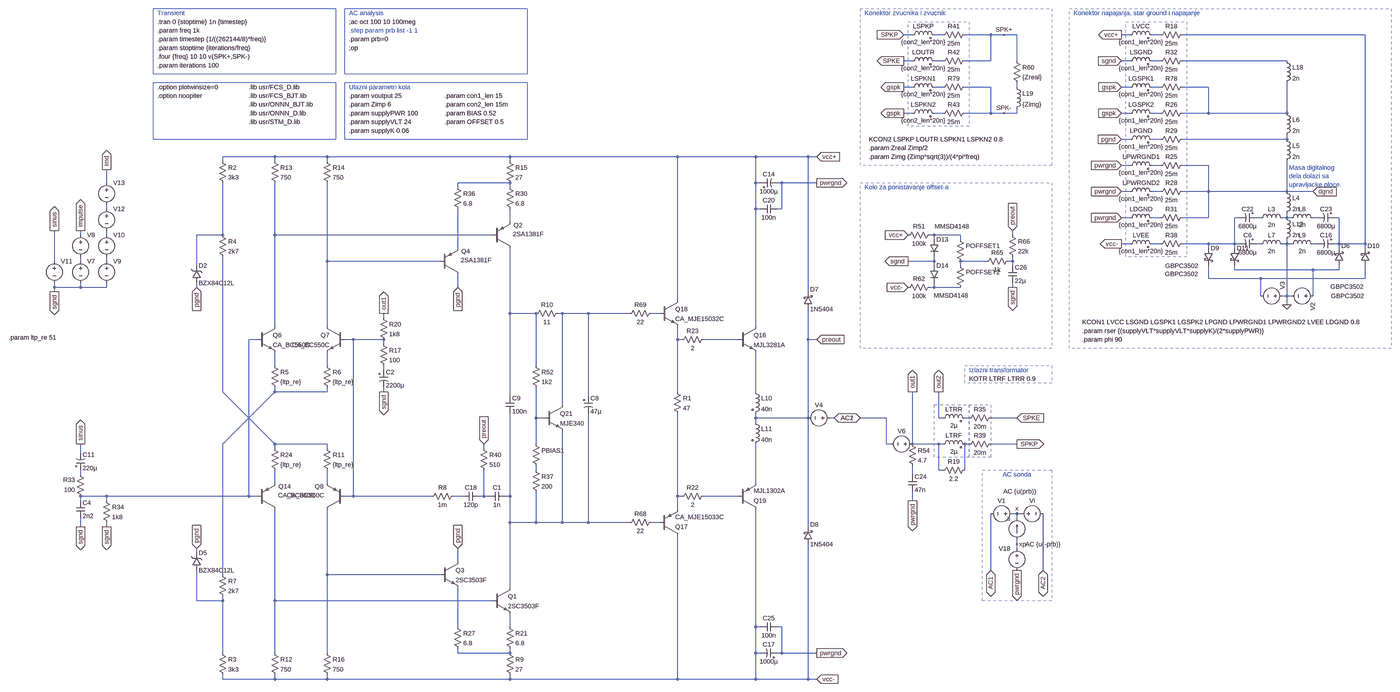
[diagram p0: schematic pico.asc, whole sheet]
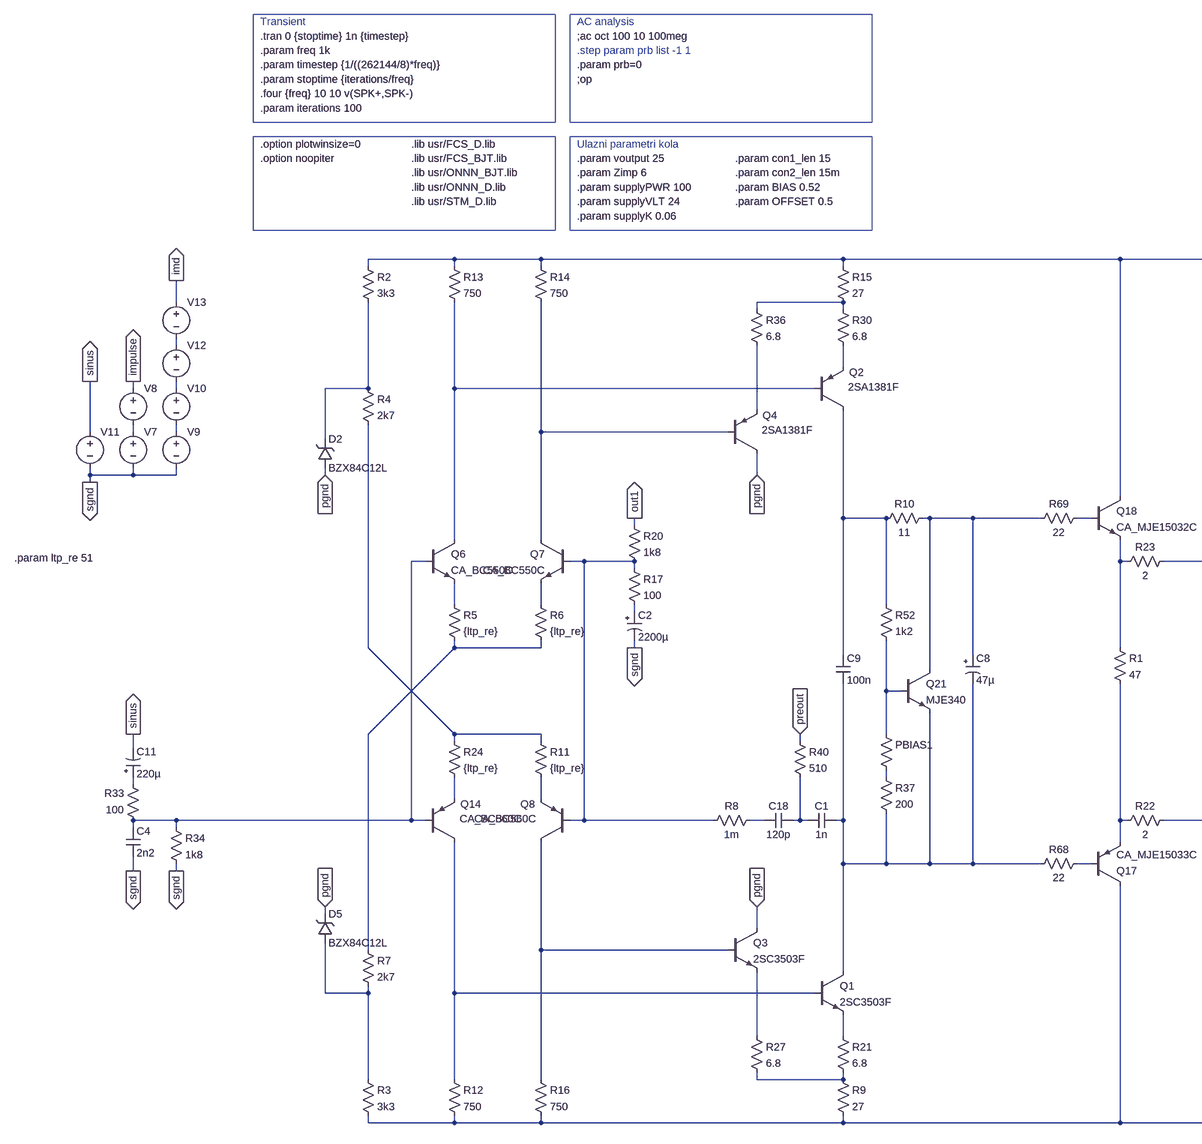
[diagram p1: schematic pico.asc, part, row 1 of 1, column 1 of 2]
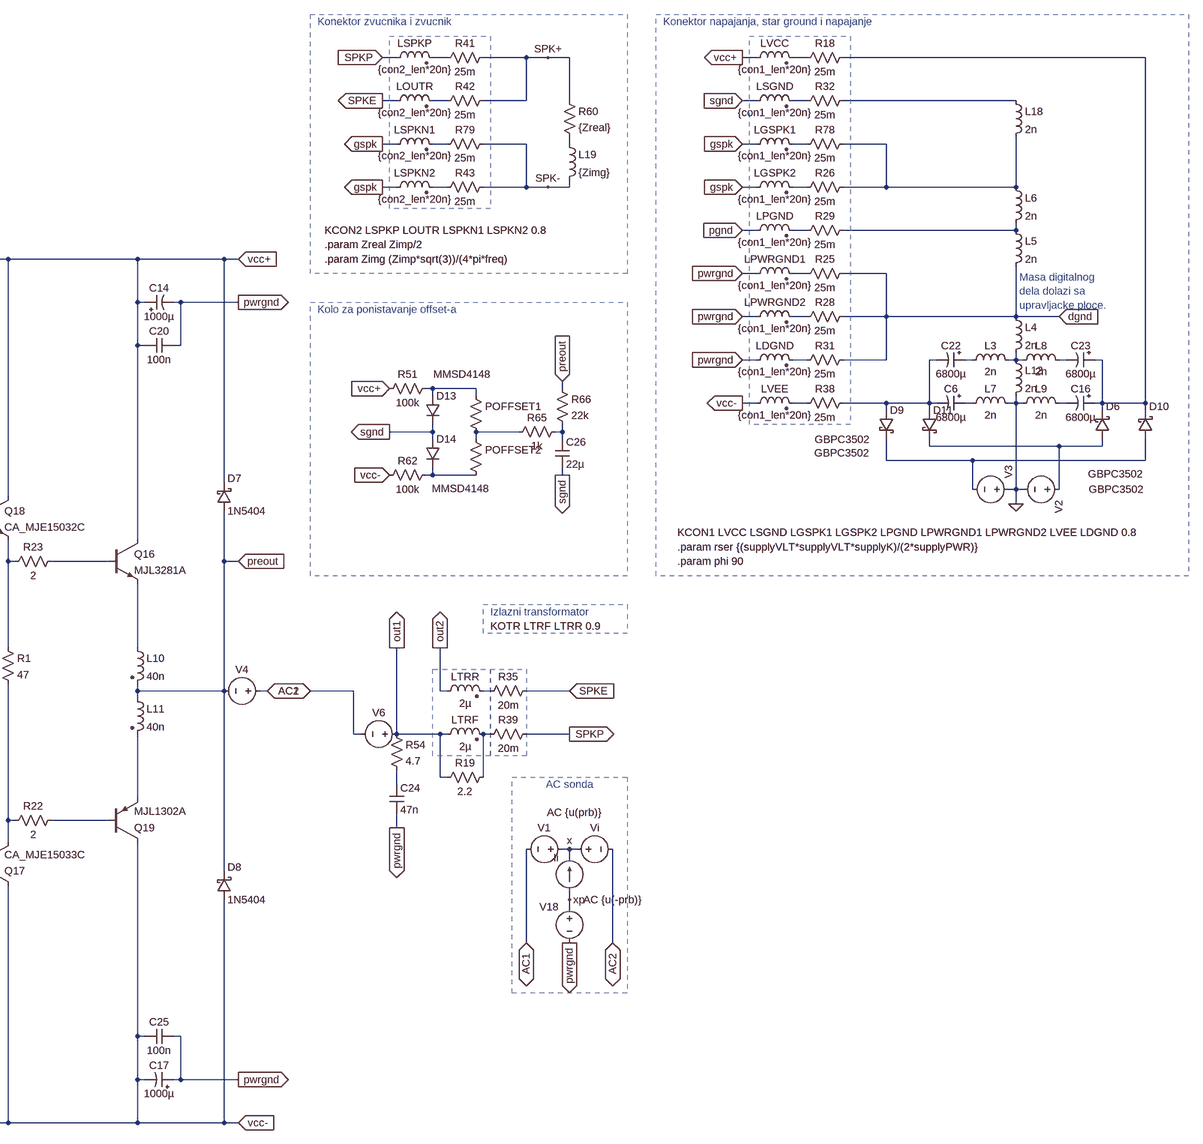
[diagram p2: schematic pico.asc, part, row 1 of 1, column 2 of 2]
pico.asc, the LTspice schematic file:
Version 4
SHEET 1 6124 2336
WIRE 2080 -1536 2048 -1536
WIRE 2192 -1536 2160 -1536
WIRE 2368 -1536 2272 -1536
WIRE 2416 -1536 2368 -1536
WIRE 2464 -1536 2416 -1536
WIRE 2880 -1536 2848 -1536
WIRE 2992 -1536 2960 -1536
WIRE 3744 -1536 3072 -1536
WIRE 2080 -1440 2048 -1440
WIRE 2192 -1440 2160 -1440
WIRE 2368 -1440 2368 -1536
WIRE 2368 -1440 2272 -1440
WIRE 2464 -1440 2464 -1536
WIRE 2880 -1440 2848 -1440
WIRE 2992 -1440 2960 -1440
WIRE 3456 -1440 3072 -1440
WIRE 2080 -1344 2048 -1344
WIRE 2192 -1344 2160 -1344
WIRE 2368 -1344 2272 -1344
WIRE 2464 -1344 2464 -1360
WIRE 2880 -1344 2848 -1344
WIRE 2992 -1344 2960 -1344
WIRE 3168 -1344 3072 -1344
WIRE 2080 -1248 2048 -1248
WIRE 2192 -1248 2160 -1248
WIRE 2368 -1248 2368 -1344
WIRE 2368 -1248 2272 -1248
WIRE 2416 -1248 2368 -1248
WIRE 2464 -1248 2464 -1264
WIRE 2464 -1248 2416 -1248
WIRE 2880 -1248 2848 -1248
WIRE 2992 -1248 2960 -1248
WIRE 3168 -1248 3168 -1344
WIRE 3168 -1248 3072 -1248
WIRE 3456 -1248 3456 -1360
WIRE 3456 -1248 3168 -1248
WIRE 2880 -1152 2848 -1152
WIRE 2992 -1152 2960 -1152
WIRE 3456 -1152 3456 -1168
WIRE 3456 -1152 3072 -1152
WIRE -320 -1088 -512 -1088
WIRE -128 -1088 -320 -1088
WIRE 544 -1088 -128 -1088
WIRE 1216 -1088 544 -1088
WIRE 1344 -1088 1216 -1088
WIRE 1504 -1088 1344 -1088
WIRE 1696 -1088 1504 -1088
WIRE 1728 -1088 1696 -1088
WIRE -512 -1072 -512 -1088
WIRE -320 -1072 -320 -1088
WIRE -128 -1072 -128 -1088
WIRE 544 -1072 544 -1088
WIRE 2880 -1056 2848 -1056
WIRE 2992 -1056 2960 -1056
WIRE 3168 -1056 3072 -1056
WIRE -992 -992 -992 -1040
WIRE 544 -992 352 -992
WIRE 1504 -992 1504 -1088
WIRE 1520 -992 1504 -992
WIRE 1600 -992 1584 -992
WIRE 1728 -992 1600 -992
WIRE 352 -976 352 -992
WIRE 544 -976 544 -992
WIRE 2880 -960 2848 -960
WIRE 2992 -960 2960 -960
WIRE 3168 -960 3168 -1056
WIRE 3168 -960 3072 -960
WIRE 3456 -960 3456 -1072
WIRE 3456 -960 3168 -960
WIRE 3552 -960 3456 -960
WIRE -992 -896 -992 -912
WIRE 1504 -896 1504 -992
WIRE 1520 -896 1504 -896
WIRE 1600 -896 1600 -992
WIRE 1600 -896 1584 -896
WIRE 2880 -864 2848 -864
WIRE 2992 -864 2960 -864
WIRE 3168 -864 3168 -960
WIRE 3168 -864 3072 -864
WIRE 3280 -864 3264 -864
WIRE 3360 -864 3344 -864
WIRE 3456 -864 3456 -880
WIRE 3456 -864 3440 -864
WIRE 3472 -864 3456 -864
WIRE 3568 -864 3552 -864
WIRE 3648 -864 3632 -864
WIRE 544 -848 544 -896
WIRE -1088 -800 -1088 -816
WIRE -992 -800 -992 -816
WIRE -512 -800 -512 -992
WIRE -512 -800 -608 -800
WIRE -320 -800 -320 -992
WIRE 480 -800 -320 -800
WIRE 2160 -800 2144 -800
WIRE 2256 -800 2160 -800
WIRE 2448 -800 2448 -816
WIRE 2160 -784 2160 -800
WIRE 2256 -784 2256 -800
WIRE 2880 -768 2848 -768
WIRE 2992 -768 2960 -768
WIRE 3168 -768 3072 -768
WIRE 3264 -768 3264 -864
WIRE 3264 -768 3168 -768
WIRE 3280 -768 3264 -768
WIRE 3360 -768 3344 -768
WIRE 3456 -768 3456 -784
WIRE 3456 -768 3440 -768
WIRE 3472 -768 3456 -768
WIRE 3568 -768 3552 -768
WIRE 3648 -768 3648 -864
WIRE 3648 -768 3632 -768
WIRE 3744 -768 3744 -1536
WIRE 3744 -768 3648 -768
WIRE 352 -752 352 -896
WIRE 3168 -752 3168 -768
WIRE 3264 -752 3264 -768
WIRE 3648 -752 3648 -768
WIRE 3744 -752 3744 -768
WIRE -1184 -704 -1184 -816
WIRE -1088 -704 -1088 -720
WIRE -992 -704 -992 -720
WIRE -128 -704 -128 -992
WIRE 288 -704 -128 -704
WIRE 1216 -704 1216 -1088
WIRE 1504 -704 1504 -896
WIRE 2160 -704 2160 -720
WIRE 2160 -704 2064 -704
WIRE 2352 -704 2256 -704
WIRE 2448 -704 2448 -720
WIRE 2448 -704 2432 -704
WIRE -608 -688 -608 -800
WIRE 2160 -688 2160 -704
WIRE 2256 -688 2256 -704
WIRE 2448 -688 2448 -704
WIRE 3264 -672 3264 -688
WIRE 3552 -672 3264 -672
WIRE 3648 -672 3648 -688
WIRE 3648 -672 3552 -672
WIRE 3168 -640 3168 -688
WIRE 3360 -640 3168 -640
WIRE 3744 -640 3744 -688
WIRE 3744 -640 3360 -640
WIRE -1184 -608 -1184 -624
WIRE -1088 -608 -1088 -624
WIRE -1088 -608 -1184 -608
WIRE -992 -608 -992 -624
WIRE -992 -608 -1088 -608
WIRE -608 -608 -608 -624
WIRE 352 -608 352 -656
WIRE 2160 -608 2160 -624
WIRE 2160 -608 2144 -608
WIRE 2256 -608 2160 -608
WIRE 2448 -608 2448 -624
WIRE -1184 -592 -1184 -608
WIRE 1696 -592 1696 -1088
WIRE 3360 -576 3360 -640
WIRE 3456 -576 3456 -768
WIRE 3456 -576 3440 -576
WIRE 3472 -576 3456 -576
WIRE 3552 -576 3552 -672
WIRE 1216 -560 1216 -704
WIRE 3456 -544 3456 -576
WIRE 544 -512 544 -752
WIRE 640 -512 544 -512
WIRE 736 -512 720 -512
WIRE 832 -512 736 -512
WIRE 1040 -512 832 -512
WIRE 1152 -512 1120 -512
WIRE 80 -496 80 -512
WIRE -320 -464 -320 -800
WIRE -128 -464 -128 -704
WIRE 1504 -464 1504 -704
WIRE -384 -416 -416 -416
WIRE -32 -416 -64 -416
WIRE 80 -416 -32 -416
WIRE 1216 -416 1216 -464
WIRE 1232 -416 1216 -416
WIRE 1440 -416 1312 -416
WIRE 1696 -416 1696 -528
WIRE 1728 -416 1696 -416
WIRE 80 -400 80 -416
WIRE -320 -320 -320 -368
WIRE -128 -320 -128 -368
WIRE 640 -320 640 -512
WIRE 80 -304 80 -320
WIRE -512 -224 -512 -720
WIRE -320 -224 -320 -240
WIRE -128 -224 -128 -240
WIRE -128 -224 -320 -224
WIRE 80 -224 80 -240
WIRE 1216 -224 1216 -416
WIRE 1504 -224 1504 -368
WIRE 544 -208 544 -512
WIRE 832 -208 832 -512
WIRE 736 -176 736 -512
WIRE 640 -128 640 -240
WIRE 672 -128 640 -128
WIRE 1504 -128 1504 -144
WIRE 1600 -128 1504 -128
WIRE 1696 -128 1696 -416
WIRE 1696 -128 1600 -128
WIRE 1792 -128 1776 -128
WIRE 1984 -128 1888 -128
WIRE 2176 -128 2176 -224
WIRE 2192 -128 2176 -128
WIRE 2288 -128 2272 -128
WIRE 2464 -128 2368 -128
WIRE 1504 -112 1504 -128
WIRE -512 -32 -320 -224
WIRE -320 -32 -512 -224
WIRE -128 -32 -320 -32
WIRE 640 -32 640 -128
WIRE 1984 -32 1984 -128
WIRE 2000 -32 1984 -32
WIRE 2080 -32 2080 -224
WIRE 2176 -32 2080 -32
WIRE 2192 -32 2176 -32
WIRE 2288 -32 2272 -32
WIRE 2464 -32 2368 -32
WIRE -320 -16 -320 -32
WIRE -128 -16 -128 -32
WIRE 448 -16 448 -32
WIRE -1088 0 -1088 -32
WIRE 640 64 640 48
WIRE 2176 64 2176 -32
WIRE 2192 64 2176 64
WIRE 2272 64 2272 -32
WIRE -1088 80 -1088 64
WIRE 2080 80 2080 48
WIRE -320 112 -320 64
WIRE -128 112 -128 64
WIRE 1504 112 1504 -32
WIRE -992 160 -1088 160
WIRE -416 160 -416 -416
WIRE -416 160 -992 160
WIRE -384 160 -416 160
WIRE -32 160 -32 -416
WIRE -32 160 -64 160
WIRE 256 160 -32 160
WIRE 368 160 336 160
WIRE 448 160 448 64
WIRE 448 160 432 160
WIRE 464 160 448 160
WIRE 544 160 544 -144
WIRE 544 160 528 160
WIRE 1216 160 1216 -144
WIRE 1232 160 1216 160
WIRE 1440 160 1312 160
WIRE -1088 176 -1088 160
WIRE -992 176 -992 160
WIRE 2080 176 2080 144
WIRE 1216 208 1216 160
WIRE 2464 224 2448 224
WIRE 2480 224 2464 224
WIRE 2464 240 2464 224
WIRE 544 256 544 160
WIRE 640 256 640 144
WIRE 640 256 544 256
WIRE 736 256 736 -80
WIRE 736 256 640 256
WIRE 832 256 832 -144
WIRE 832 256 736 256
WIRE 1040 256 832 256
WIRE 1152 256 1120 256
WIRE -1088 272 -1088 240
WIRE -992 272 -992 256
WIRE 1696 272 1696 -128
WIRE 2464 336 2464 320
WIRE 2464 352 2464 336
WIRE -608 368 -608 352
WIRE 352 400 352 352
WIRE 2368 432 2368 224
WIRE 2560 432 2560 224
WIRE -512 448 -512 -32
WIRE -128 448 -128 208
WIRE 288 448 -128 448
WIRE 544 496 544 256
WIRE -608 544 -608 432
WIRE -512 544 -512 528
WIRE -512 544 -608 544
WIRE -320 544 -320 208
WIRE 480 544 -320 544
WIRE 352 640 352 496
WIRE 544 640 544 592
WIRE 1504 640 1504 208
WIRE 1520 640 1504 640
WIRE 1600 640 1584 640
WIRE -512 736 -512 544
WIRE -320 736 -320 544
WIRE -128 736 -128 448
WIRE 352 736 352 720
WIRE 544 736 544 720
WIRE 544 736 352 736
WIRE 1504 736 1504 640
WIRE 1520 736 1504 736
WIRE 1600 736 1600 640
WIRE 1600 736 1584 736
WIRE 1728 736 1600 736
WIRE -512 832 -512 816
WIRE -320 832 -320 816
WIRE -320 832 -512 832
WIRE -128 832 -128 816
WIRE -128 832 -320 832
WIRE 544 832 544 816
WIRE 544 832 -128 832
WIRE 1216 832 1216 304
WIRE 1216 832 544 832
WIRE 1344 832 1216 832
WIRE 1504 832 1504 736
WIRE 1504 832 1344 832
WIRE 1696 832 1696 336
WIRE 1696 832 1504 832
WIRE 1728 832 1696 832
FLAG 1728 -1088 vcc+
IOPIN 1728 -1088 In
FLAG 2464 224 x
FLAG 1728 832 vcc-
IOPIN 1728 832 In
FLAG 2080 -224 out1
IOPIN 2080 -224 Out
FLAG 2464 336 xp
FLAG 2080 176 pwrgnd
IOPIN 2080 176 Out
FLAG -1088 272 sgnd
IOPIN -1088 272 Out
FLAG -992 272 sgnd
IOPIN -992 272 Out
FLAG 1728 -992 pwrgnd
IOPIN 1728 -992 Out
FLAG 2176 -224 out2
IOPIN 2176 -224 Out
FLAG -1184 -592 sgnd
IOPIN -1184 -592 Out
FLAG -1184 -816 sinus
IOPIN -1184 -816 Out
FLAG 1728 736 pwrgnd
IOPIN 1728 736 Out
FLAG 2848 -1536 vcc+
IOPIN 2848 -1536 Out
FLAG 2848 -768 vcc-
IOPIN 2848 -768 Out
FLAG 2848 -1248 gspk
IOPIN 2848 -1248 In
FLAG 2848 -960 pwrgnd
IOPIN 2848 -960 In
FLAG 2848 -1152 pgnd
IOPIN 2848 -1152 In
FLAG 2848 -1440 sgnd
IOPIN 2848 -1440 In
FLAG 2464 -32 SPKP
IOPIN 2464 -32 Out
FLAG 2048 -1248 gspk
IOPIN 2048 -1248 Out
FLAG 2048 -1536 SPKP
IOPIN 2048 -1536 In
FLAG 2048 -1440 SPKE
IOPIN 2048 -1440 Out
FLAG 3552 -960 dgnd
IOPIN 3552 -960 In
FLAG 2848 -1056 pwrgnd
IOPIN 2848 -1056 In
FLAG -1088 -816 impulse
IOPIN -1088 -816 Out
FLAG 2848 -864 pwrgnd
IOPIN 2848 -864 In
FLAG 3456 -544 0
FLAG 2064 -800 vcc+
IOPIN 2064 -800 In
FLAG 2064 -608 vcc-
IOPIN 2064 -608 In
FLAG 2064 -704 sgnd
IOPIN 2064 -704 Out
FLAG 2448 -608 sgnd
IOPIN 2448 -608 Out
FLAG 2368 432 AC1
IOPIN 2368 432 BiDir
FLAG 2560 432 AC2
IOPIN 2560 432 BiDir
FLAG 1792 -128 AC1
IOPIN 1792 -128 BiDir
FLAG 1888 -128 AC2
IOPIN 1888 -128 BiDir
FLAG 2464 432 pwrgnd
IOPIN 2464 432 Out
FLAG 2416 -1536 SPK+
FLAG 2416 -1248 SPK-
FLAG 2464 -128 SPKE
IOPIN 2464 -128 In
FLAG 2848 -1344 gspk
IOPIN 2848 -1344 In
FLAG 2048 -1344 gspk
IOPIN 2048 -1344 Out
FLAG 1728 -416 preout
IOPIN 1728 -416 In
FLAG -992 -1040 imd
IOPIN -992 -1040 Out
FLAG 80 -224 sgnd
IOPIN 80 -224 Out
FLAG 2448 -816 preout
IOPIN 2448 -816 In
FLAG 80 -512 out1
IOPIN 80 -512 Out
FLAG -1088 -32 sinus
IOPIN -1088 -32 Out
FLAG -608 -608 pgnd
IOPIN -608 -608 In
FLAG -608 352 pgnd
IOPIN -608 352 In
FLAG 352 352 pgnd
IOPIN 352 352 In
FLAG 352 -608 pgnd
IOPIN 352 -608 In
FLAG 448 -32 preout
IOPIN 448 -32 In
DATAFLAG 1600 -128 ""
DATAFLAG 1504 -704 "ic(q16)"
DATAFLAG 1344 -1088 ""
DATAFLAG 1344 832 ""
DATAFLAG 1216 -704 "Ic(Q18)"
SYMBOL voltage 3568 -576 R90
WINDOW 123 0 0 Left 2
WINDOW 3 -94 177 Invisible 2
SYMATTR Value SINE(0 {supplyVLT*sqrt(2)} 50 0 0 {phi})
SYMATTR SpiceLine Rser={rser}
SYMATTR InstName V2
SYMBOL current 2464 320 R180
WINDOW 0 24 77 Left 2
WINDOW 3 24 0 Invisible 2
WINDOW 123 -71 178 Left 2
WINDOW 39 0 0 Left 2
SYMATTR InstName Ii
SYMATTR Value 0
SYMATTR Value2 AC {u(prb)}
SYMBOL voltage 2464 224 R270
WINDOW 0 32 56 VTop 2
WINDOW 3 -32 56 Invisible 2
WINDOW 123 -97 96 VBottom 2
WINDOW 39 -32 56 VBottom 2
SYMATTR InstName Vi
SYMATTR Value 0
SYMATTR Value2 AC {u(-prb)}
SYMBOL res -1072 176 R180
WINDOW 0 36 76 Left 2
WINDOW 3 36 40 Left 2
SYMATTR InstName R33
SYMATTR Value 100
SYMBOL res -1008 160 R0
SYMATTR InstName R34
SYMATTR Value 1k8
SYMBOL schottky 1680 -528 M180
WINDOW 0 24 72 Left 2
WINDOW 3 24 0 Left 2
SYMATTR InstName D7
SYMATTR Value 1N5404
SYMATTR Description Diode
SYMATTR Type diode
SYMBOL schottky 1680 336 M180
WINDOW 0 24 72 Left 2
WINDOW 3 24 0 Left 2
SYMATTR InstName D8
SYMATTR Value 1N5404
SYMATTR Description Diode
SYMATTR Type diode
SYMBOL ind2 2176 -16 R270
WINDOW 0 32 56 VTop 2
WINDOW 3 4 56 VBottom 2
SYMATTR InstName LTRF
SYMATTR Value 2µ
SYMATTR SpiceLine Rser=10m Rpar=3meg Cpar=1p
SYMATTR Type ind
SYMBOL res 2176 80 R270
WINDOW 0 32 56 VTop 2
WINDOW 3 0 56 VBottom 2
SYMATTR InstName R19
SYMATTR Value 2.2
SYMBOL voltage 2464 224 R90
WINDOW 0 -32 56 VBottom 2
WINDOW 3 32 56 Invisible 2
WINDOW 123 0 0 Left 2
WINDOW 39 0 0 Left 2
SYMATTR InstName V1
SYMATTR Value 0
SYMBOL schottky 3632 -688 M180
WINDOW 0 24 72 Left 2
WINDOW 3 -14 -112 Left 2
SYMATTR InstName D6
SYMATTR Value GBPC3502
SYMATTR Description Diode
SYMATTR Type diode
SYMBOL schottky 3152 -752 R0
WINDOW 3 -144 95 Left 2
SYMATTR Value GBPC3502
SYMATTR InstName D9
SYMATTR Description Diode
SYMATTR Type diode
SYMBOL voltage 3456 -576 M270
WINDOW 123 0 0 Left 2
WINDOW 3 -96 -62 Invisible 2
SYMATTR Value SINE(0 {supplyVLT*sqrt(2)} 50 0 0 {phi})
SYMATTR SpiceLine Rser={rser}
SYMATTR InstName V3
SYMBOL res 2064 -48 R0
SYMATTR InstName R54
SYMATTR Value 4.7
SYMBOL res 2448 -1456 R0
SYMATTR InstName R60
SYMATTR Value {Zreal}
SYMBOL ind 2448 -1360 R0
SYMATTR InstName L19
SYMATTR Value {Zimg}
SYMATTR SpiceLine Cpar=10p
SYMBOL voltage 2464 336 M0
WINDOW 123 0 0 Left 2
WINDOW 39 0 0 Left 2
WINDOW 3 24 96 Invisible 2
SYMATTR Value 0
SYMATTR InstName V18
SYMBOL npn 1440 -464 R0
SYMATTR InstName Q16
SYMATTR Value MJL3281A
SYMBOL pnp 1152 304 M180
SYMATTR InstName Q17
SYMATTR Value CA_MJE15033C
SYMBOL npn 1152 -560 R0
SYMATTR InstName Q18
SYMATTR Value CA_MJE15032C
SYMBOL pnp 1440 208 M180
SYMATTR InstName Q19
SYMATTR Value MJL1302A
SYMBOL res 1328 144 R90
WINDOW 0 0 56 VBottom 2
WINDOW 3 32 56 VTop 2
SYMATTR InstName R22
SYMATTR Value 2
SYMBOL res 1328 -432 R90
WINDOW 0 0 56 VBottom 2
WINDOW 3 32 56 VTop 2
SYMATTR InstName R23
SYMATTR Value 2
SYMBOL cap 1520 -912 M90
WINDOW 0 0 32 VBottom 2
WINDOW 3 32 32 VTop 2
SYMATTR InstName C20
SYMATTR Value 100n
SYMATTR SpiceLine Rser=700m Lser=7n Rpar=4.4meg Cpar=1p
SYMBOL ind2 1488 -240 R0
SYMATTR InstName L10
SYMATTR Value 40n
SYMATTR SpiceLine Rser=220m Cpar=3p
SYMATTR Type ind
SYMBOL ind2 1488 -128 R0
SYMATTR InstName L11
SYMATTR Value 40n
SYMATTR SpiceLine Rser=220m Cpar=3p
SYMATTR Type ind
SYMBOL cap 2064 80 R0
SYMATTR InstName C24
SYMATTR Value 47n
SYMATTR SpiceLine Rser=700m Lser=7n Rpar=4.4meg Cpar=1p
SYMBOL cap 1584 624 R90
WINDOW 0 0 32 VBottom 2
WINDOW 3 32 32 VTop 2
SYMATTR InstName C25
SYMATTR Value 100n
SYMATTR SpiceLine Rser=700m Lser=7n Rpar=4.4meg Cpar=1p
SYMBOL polcap 64 -304 R0
SYMATTR InstName C2
SYMATTR Value 2200µ
SYMATTR SpiceLine V=10 Irms=1.25 Rser=0.08 Lser=10n Rpar=110k Cpar=3p
SYMATTR Description Capacitor
SYMATTR Type cap
SYMBOL polcap 3344 -784 R90
WINDOW 0 0 32 VBottom 2
WINDOW 3 32 32 VTop 2
SYMATTR InstName C6
SYMATTR Value 6800µ
SYMATTR SpiceLine V=50 Irms=2.5 Rser=0.08 Lser=20n Rpar=40k Cpar=3p mfg="Nichicon" pn="UVZ1H682MRD" type="Al electrolytic"
SYMATTR Description Capacitor
SYMATTR Type cap
SYMBOL res 624 -48 R0
WINDOW 3 36 76 Invisible 2
SYMATTR Value {1+(500*BIAS)}
SYMATTR InstName PBIAS1
SYMBOL res 624 -336 R0
SYMATTR InstName R52
SYMATTR Value 1k2
SYMBOL schottky 3728 -688 M180
WINDOW 0 24 72 Left 2
WINDOW 3 -112 -78 Left 2
SYMATTR InstName D10
SYMATTR Value GBPC3502
SYMATTR Description Diode
SYMATTR Type diode
SYMBOL schottky 3248 -752 R0
WINDOW 3 -239 65 Left 2
SYMATTR Value GBPC3502
SYMATTR InstName D11
SYMATTR Description Diode
SYMATTR Type diode
SYMBOL ind2 2864 -1520 R270
WINDOW 0 32 56 VTop 2
WINDOW 3 5 56 VBottom 2
SYMATTR InstName LVCC
SYMATTR Value {con1_len*20n}
SYMATTR SpiceLine Rser={con1_len*.5m}
SYMATTR Type ind
SYMBOL ind2 2864 -752 R270
WINDOW 0 32 56 VTop 2
WINDOW 3 5 56 VBottom 2
SYMATTR InstName LVEE
SYMATTR Value {con1_len*20n}
SYMATTR SpiceLine Rser={con1_len*.5m}
SYMATTR Type ind
SYMBOL ind2 2176 -112 R270
WINDOW 0 32 56 VTop 2
WINDOW 3 4 56 VBottom 2
SYMATTR InstName LTRR
SYMATTR Value 2µ
SYMATTR SpiceLine Rser=80m Rpar=3meg Cpar=1p
SYMATTR Type ind
SYMBOL cap -1104 240 M180
WINDOW 0 24 56 Left 2
WINDOW 3 24 8 Left 2
SYMATTR InstName C4
SYMATTR Value 2n2
SYMBOL voltage -1184 -720 R0
WINDOW 123 24 44 Left 2
WINDOW 39 0 0 Left 2
WINDOW 3 24 96 Invisible 2
SYMATTR Value SINE(0 {voutput/18} {freq})
SYMATTR InstName V11
SYMBOL res 1200 -240 R0
SYMATTR InstName R1
SYMATTR Value 47
SYMBOL npn 672 -176 R0
SYMATTR InstName Q21
SYMATTR Value MJE340
SYMBOL ind2 2864 -1232 R270
WINDOW 0 32 56 VTop 2
WINDOW 3 5 56 VBottom 2
SYMATTR InstName LGSPK2
SYMATTR Value {con1_len*20n}
SYMATTR SpiceLine Rser={con1_len*.5m}
SYMATTR Type ind
SYMBOL ind2 2864 -944 R270
WINDOW 0 32 56 VTop 2
WINDOW 3 5 56 VBottom 2
SYMATTR InstName LPWRGND2
SYMATTR Value {con1_len*20n}
SYMATTR SpiceLine Rser={con1_len*.5m}
SYMATTR Type ind
SYMBOL ind2 2864 -1136 R270
WINDOW 0 32 56 VTop 2
WINDOW 3 5 56 VBottom 2
SYMATTR InstName LPGND
SYMATTR Value {con1_len*20n}
SYMATTR SpiceLine Rser={con1_len*.5m}
SYMATTR Type ind
SYMBOL ind2 2864 -1424 R270
WINDOW 0 32 56 VTop 2
WINDOW 3 5 56 VBottom 2
SYMATTR InstName LSGND
SYMATTR Value {con1_len*20n}
SYMATTR SpiceLine Rser={con1_len*.5m}
SYMATTR Type ind
SYMBOL res 3088 -1552 R90
WINDOW 0 0 56 VBottom 2
WINDOW 3 32 56 VTop 2
SYMATTR InstName R18
SYMATTR Value 25m
SYMBOL res 3088 -1264 R90
WINDOW 0 0 56 VBottom 2
WINDOW 3 32 56 VTop 2
SYMATTR InstName R26
SYMATTR Value 25m
SYMBOL res 3088 -976 R90
WINDOW 0 0 56 VBottom 2
WINDOW 3 32 56 VTop 2
SYMATTR InstName R28
SYMATTR Value 25m
SYMBOL res 3088 -1168 R90
WINDOW 0 0 56 VBottom 2
WINDOW 3 32 56 VTop 2
SYMATTR InstName R29
SYMATTR Value 25m
SYMBOL res 3088 -1456 R90
WINDOW 0 0 56 VBottom 2
WINDOW 3 32 56 VTop 2
SYMATTR InstName R32
SYMATTR Value 25m
SYMBOL res 3088 -784 R90
WINDOW 0 0 56 VBottom 2
WINDOW 3 32 56 VTop 2
SYMATTR InstName R38
SYMATTR Value 25m
SYMBOL ind 3440 -976 R0
SYMATTR InstName L4
SYMATTR Value 2n
SYMATTR SpiceLine Rser=1m
SYMBOL ind 3440 -1168 R0
SYMATTR InstName L5
SYMATTR Value 2n
SYMATTR SpiceLine Rser=1m
SYMBOL ind 3440 -1264 R0
SYMATTR InstName L6
SYMATTR Value 2n
SYMATTR SpiceLine Rser=1m
SYMBOL ind 3440 -1456 R0
SYMATTR InstName L18
SYMATTR Value 2n
SYMATTR SpiceLine Rser=1m
SYMBOL ind2 2064 -1520 R270
WINDOW 0 32 56 VTop 2
WINDOW 3 5 56 VBottom 2
SYMATTR InstName LSPKP
SYMATTR Value {con2_len*20n}
SYMATTR SpiceLine Rser={con2_len*.5m}
SYMATTR Type ind
SYMBOL ind2 2064 -1424 R270
WINDOW 0 32 56 VTop 2
WINDOW 3 5 56 VBottom 2
SYMATTR InstName LOUTR
SYMATTR Value {con2_len*20n}
SYMATTR SpiceLine Rser={con2_len*.5m}
SYMATTR Type ind
SYMBOL ind2 2064 -1232 R270
WINDOW 0 32 56 VTop 2
WINDOW 3 5 56 VBottom 2
SYMATTR InstName LSPKN2
SYMATTR Value {con2_len*20n}
SYMATTR SpiceLine Rser={con2_len*.5m}
SYMATTR Type ind
SYMBOL res 2384 -144 R90
WINDOW 0 0 56 VBottom 2
WINDOW 3 32 56 VTop 2
SYMATTR InstName R35
SYMATTR Value 20m
SYMBOL res 2384 -48 R90
WINDOW 0 0 56 VBottom 2
WINDOW 3 32 56 VTop 2
SYMATTR InstName R39
SYMATTR Value 20m
SYMBOL res 2288 -1552 R90
WINDOW 0 0 56 VBottom 2
WINDOW 3 32 56 VTop 2
SYMATTR InstName R41
SYMATTR Value 25m
SYMBOL res 2288 -1456 R90
WINDOW 0 0 56 VBottom 2
WINDOW 3 32 56 VTop 2
SYMATTR InstName R42
SYMATTR Value 25m
SYMBOL res 2288 -1264 R90
WINDOW 0 0 56 VBottom 2
WINDOW 3 32 56 VTop 2
SYMATTR InstName R43
SYMATTR Value 25m
SYMBOL ind2 2864 -848 R270
WINDOW 0 32 56 VTop 2
WINDOW 3 5 56 VBottom 2
SYMATTR InstName LDGND
SYMATTR Value {con1_len*20n}
SYMATTR SpiceLine Rser={con1_len*.5m}
SYMATTR Type ind
SYMBOL res 3088 -880 R90
WINDOW 0 0 56 VBottom 2
WINDOW 3 32 56 VTop 2
SYMATTR InstName R31
SYMATTR Value 25m
SYMBOL ind2 2864 -1040 R270
WINDOW 0 32 56 VTop 2
WINDOW 3 5 56 VBottom 2
SYMATTR InstName LPWRGND1
SYMATTR Value {con1_len*20n}
SYMATTR SpiceLine Rser={con1_len*.5m}
SYMATTR Type ind
SYMBOL res 3088 -1072 R90
WINDOW 0 0 56 VBottom 2
WINDOW 3 32 56 VTop 2
SYMATTR InstName R25
SYMATTR Value 25m
SYMBOL voltage -1088 -720 R0
WINDOW 3 24 96 Invisible 2
WINDOW 123 0 0 Left 2
WINDOW 39 0 0 Left 2
SYMATTR Value PULSE(0 {voutput/18} 1u 1n 1n {1/(freq*2)} {1/freq})
SYMATTR InstName V7
SYMBOL voltage -1088 -816 R0
WINDOW 3 24 96 Invisible 2
WINDOW 123 0 0 Left 2
WINDOW 39 0 0 Left 2
SYMATTR Value PULSE(0 {-voutput/18} {1u+(1/(freq*2))} 1n 1n {1/(freq*2)} {1/freq})
SYMATTR InstName V8
SYMBOL polcap -1104 64 M180
WINDOW 3 24 8 Left 2
WINDOW 0 24 57 Left 2
SYMATTR Value 220µ
SYMATTR InstName C11
SYMATTR SpiceLine V=6.3 Irms=290m Rser=0.5 Lser=3n Rpar=100k Cpar=3p mfg="Nichicon" pn="UPW0J221MED1TD" type="Al electrolytic"
SYMATTR Description Capacitor
SYMATTR Type cap
SYMBOL polcap 1520 -976 R270
WINDOW 0 32 32 VTop 2
WINDOW 3 0 32 VBottom 2
SYMATTR InstName C14
SYMATTR Value 1000µ
SYMATTR SpiceLine V=63 Irms=2.77 Rser=0.036 Lser=5n Rpar=100k Cpar=3p mfg="Nichicon" pn="UPW1J102MHD6" type="Al electrolytic"
SYMATTR Description Capacitor
SYMATTR Type cap
SYMBOL polcap 1584 752 M270
WINDOW 0 32 32 VTop 2
WINDOW 3 0 32 VBottom 2
SYMATTR InstName C17
SYMATTR Value 1000µ
SYMATTR SpiceLine V=63 Irms=2.77 Rser=0.036 Lser=5n Rpar=100k Cpar=3p mfg="Nichicon" pn="UPW1J102MHD6" type="Al electrolytic"
SYMATTR Description Capacitor
SYMATTR Type cap
SYMBOL polcap 3632 -784 R90
WINDOW 0 0 32 VBottom 2
WINDOW 3 32 32 VTop 2
SYMATTR InstName C16
SYMATTR Value 6800µ
SYMATTR SpiceLine V=50 Irms=2.5 Rser=0.08 Lser=20n Rpar=40k Cpar=3p mfg="Nichicon" pn="UVZ1H682MRD" type="Al electrolytic"
SYMATTR Description Capacitor
SYMATTR Type cap
SYMBOL polcap 3344 -880 R90
WINDOW 0 0 32 VBottom 2
WINDOW 3 32 32 VTop 2
SYMATTR InstName C22
SYMATTR Value 6800µ
SYMATTR SpiceLine V=50 Irms=2.5 Rser=0.08 Lser=20n Rpar=40k Cpar=3p mfg="Nichicon" pn="UVZ1H682MRD" type="Al electrolytic"
SYMATTR Description Capacitor
SYMATTR Type cap
SYMBOL polcap 3632 -880 R90
WINDOW 0 0 32 VBottom 2
WINDOW 3 32 32 VTop 2
SYMATTR InstName C23
SYMATTR Value 6800µ
SYMATTR SpiceLine V=50 Irms=2.5 Rser=0.08 Lser=20n Rpar=40k Cpar=3p mfg="Nichicon" pn="UVZ1H682MRD" type="Al electrolytic"
SYMATTR Description Capacitor
SYMATTR Type cap
SYMBOL ind 3344 -848 R270
WINDOW 0 32 56 VTop 2
WINDOW 3 5 56 VBottom 2
SYMATTR InstName L3
SYMATTR Value 2n
SYMATTR SpiceLine Rser=1m
SYMBOL ind 3344 -752 R270
WINDOW 0 32 56 VTop 2
WINDOW 3 5 56 VBottom 2
SYMATTR InstName L7
SYMATTR Value 2n
SYMATTR SpiceLine Rser=1m
SYMBOL ind 3456 -848 R270
WINDOW 0 32 56 VTop 2
WINDOW 3 5 56 VBottom 2
SYMATTR InstName L8
SYMATTR Value 2n
SYMATTR SpiceLine Rser=1m
SYMBOL ind 3456 -752 R270
WINDOW 0 32 56 VTop 2
WINDOW 3 5 56 VBottom 2
SYMATTR InstName L9
SYMATTR Value 2n
SYMATTR SpiceLine Rser=1m
SYMBOL ind 3440 -880 R0
SYMATTR InstName L12
SYMATTR Value 2n
SYMATTR SpiceLine Rser=1m
SYMBOL res 624 48 R0
SYMATTR InstName R37
SYMATTR Value 200
SYMBOL res 2048 -784 R270
WINDOW 0 32 56 VTop 2
WINDOW 3 0 56 VBottom 2
SYMATTR InstName R51
SYMATTR Value 100k
SYMBOL res 2160 -624 R90
WINDOW 0 0 56 VBottom 2
WINDOW 3 32 56 VTop 2
SYMATTR InstName R62
SYMATTR Value 100k
SYMBOL diode 2144 -784 R0
WINDOW 3 17 -48 Left 2
SYMATTR Value MMSD4148
SYMATTR InstName D13
SYMBOL diode 2144 -688 R0
WINDOW 3 14 110 Left 2
SYMATTR Value MMSD4148
SYMATTR InstName D14
SYMBOL res 2240 -800 R0
WINDOW 3 45 -160 Invisible 2
SYMATTR Value {1+(10k*OFFSET)}
SYMATTR InstName POFFSET1
SYMBOL res 2240 -704 R0
WINDOW 3 49 222 Invisible 2
SYMATTR Value {1+(10k*(1-OFFSET))}
SYMATTR InstName POFFSET2
SYMBOL res 2448 -720 R90
WINDOW 0 0 56 VBottom 2
WINDOW 3 32 56 VTop 2
SYMATTR InstName R65
SYMATTR Value 1k
SYMBOL cap 2432 -624 M180
WINDOW 0 24 57 Left 2
WINDOW 3 24 8 Left 2
SYMATTR InstName C26
SYMATTR Value 22µ
SYMATTR SpiceLine V=50 Irms=90m Rser=2 Lser=2n Rpar=2meg Cpar=2p mfg="Panasonic" pn="ECEA1HN220U" type="Al bipolar"
SYMBOL res 2432 -816 R0
SYMATTR InstName R66
SYMATTR Value 22k
SYMBOL voltage 1792 -128 R90
WINDOW 0 -32 56 VBottom 2
WINDOW 3 32 56 Invisible 2
WINDOW 123 0 0 Left 2
WINDOW 39 0 0 Left 2
SYMATTR InstName V4
SYMATTR Value 0
SYMBOL voltage 2096 -32 R90
WINDOW 0 -32 56 VBottom 2
WINDOW 3 32 56 Invisible 2
WINDOW 123 0 0 Left 2
WINDOW 39 0 0 Left 2
SYMATTR InstName V6
SYMATTR Value 0
SYMBOL res 1136 240 R90
WINDOW 0 0 56 VBottom 2
WINDOW 3 32 56 VTop 2
SYMATTR InstName R68
SYMATTR Value 22
SYMBOL res 1136 -528 R90
WINDOW 0 0 56 VBottom 2
WINDOW 3 32 56 VTop 2
SYMATTR InstName R69
SYMATTR Value 22
SYMBOL ind2 2864 -1328 R270
WINDOW 0 32 56 VTop 2
WINDOW 3 5 56 VBottom 2
SYMATTR InstName LGSPK1
SYMATTR Value {con1_len*20n}
SYMATTR SpiceLine Rser={con1_len*.5m}
SYMATTR Type ind
SYMBOL res 3088 -1360 R90
WINDOW 0 0 56 VBottom 2
WINDOW 3 32 56 VTop 2
SYMATTR InstName R78
SYMATTR Value 25m
SYMBOL ind2 2064 -1328 R270
WINDOW 0 32 56 VTop 2
WINDOW 3 5 56 VBottom 2
SYMATTR InstName LSPKN1
SYMATTR Value {con2_len*20n}
SYMATTR SpiceLine Rser={con2_len*.5m}
SYMATTR Type ind
SYMBOL res 2288 -1360 R90
WINDOW 0 0 56 VBottom 2
WINDOW 3 32 56 VTop 2
SYMATTR InstName R79
SYMATTR Value 25m
SYMBOL voltage -992 -720 R0
WINDOW 3 24 96 Invisible 2
WINDOW 123 0 0 Left 2
WINDOW 39 0 0 Left 2
SYMATTR Value SINE(0 {voutput/72} 19k)
SYMATTR InstName V9
SYMBOL voltage -992 -816 R0
WINDOW 3 24 96 Invisible 2
WINDOW 123 0 0 Left 2
WINDOW 39 0 0 Left 2
SYMATTR Value SINE(0 {voutput/72} 17k)
SYMATTR InstName V10
SYMBOL npn 480 496 R0
SYMATTR InstName Q1
SYMATTR Value 2SC3503F
SYMBOL res 736 -528 R90
WINDOW 0 0 56 VBottom 2
WINDOW 3 32 56 VTop 2
SYMATTR InstName R10
SYMATTR Value 11
SYMBOL polcap 816 -208 R0
SYMATTR Value 47µ
SYMATTR InstName C8
SYMATTR SpiceLine V=6.3 Irms=290m Rser=0.5 Lser=3n Rpar=100k Cpar=3p mfg="Nichicon" pn="UPW0J221MED1TD" type="Al electrolytic"
SYMATTR Description Capacitor
SYMATTR Type cap
SYMBOL cap 368 176 R270
WINDOW 0 32 32 VTop 2
WINDOW 3 0 32 VBottom 2
SYMATTR InstName C18
SYMATTR Value 120p
SYMBOL pnp -384 208 M180
WINDOW 0 77 84 Left 2
WINDOW 3 75 52 Left 2
SYMATTR InstName Q14
SYMATTR Value CA_BC560C
SYMBOL cap 528 -208 R0
SYMATTR InstName C9
SYMATTR Value 100n
SYMATTR SpiceLine Rser=30m Lser=3n Rpar=700k
SYMBOL res 240 176 R270
WINDOW 0 32 56 VTop 2
WINDOW 3 0 56 VBottom 2
SYMATTR InstName R8
SYMATTR Value 1m
SYMBOL voltage -992 -912 R0
WINDOW 3 24 96 Invisible 2
WINDOW 123 0 0 Left 2
WINDOW 39 0 0 Left 2
SYMATTR Value SINE(0 {voutput/72} 3k)
SYMATTR InstName V12
SYMBOL voltage -992 -1008 R0
WINDOW 3 24 96 Invisible 2
WINDOW 123 0 0 Left 2
WINDOW 39 0 0 Left 2
SYMATTR Value SINE(0 {voutput/72} 5k)
SYMATTR InstName V13
SYMBOL res -336 -32 R0
SYMATTR InstName R24
SYMATTR Value {ltp_re}
SYMBOL pnp 480 -752 M180
WINDOW 0 77 84 Left 2
WINDOW 3 75 52 Left 2
SYMATTR InstName Q2
SYMATTR Value 2SA1381F
SYMBOL npn -384 -464 R0
SYMATTR InstName Q6
SYMATTR Value CA_BC550C
SYMBOL res -336 -336 R0
SYMATTR InstName R5
SYMATTR Value {ltp_re}
SYMBOL res -336 720 R0
SYMATTR InstName R12
SYMATTR Value 750
SYMBOL res -336 -1088 R0
SYMATTR InstName R13
SYMATTR Value 750
SYMBOL npn -64 -464 M0
SYMATTR InstName Q7
SYMATTR Value CA_BC550C
SYMBOL res -144 -336 R0
SYMATTR InstName R6
SYMATTR Value {ltp_re}
SYMBOL res -144 -32 R0
SYMATTR InstName R11
SYMATTR Value {ltp_re}
SYMBOL pnp -64 208 R180
WINDOW 0 77 84 Left 2
WINDOW 3 75 52 Left 2
SYMATTR InstName Q8
SYMATTR Value CA_BC560C
SYMBOL res 64 -416 R0
SYMATTR InstName R17
SYMATTR Value 100
SYMBOL res 64 -512 R0
SYMATTR InstName R20
SYMATTR Value 1k8
SYMBOL res 528 720 R0
SYMATTR InstName R9
SYMATTR Value 27
SYMBOL res 528 -1088 R0
SYMATTR InstName R15
SYMATTR Value 27
SYMBOL res -528 -816 R0
SYMATTR InstName R4
SYMATTR Value 2k7
SYMBOL res -528 432 R0
SYMATTR InstName R7
SYMATTR Value 2k7
SYMBOL zener -624 -624 M180
WINDOW 0 24 64 Left 2
WINDOW 3 24 0 Left 2
SYMATTR InstName D2
SYMATTR Value BZX84C12L
SYMATTR Description Diode
SYMATTR Type diode
SYMBOL zener -624 432 M180
WINDOW 0 24 64 Left 2
WINDOW 3 24 0 Left 2
SYMATTR InstName D5
SYMATTR Value BZX84C12L
SYMATTR Description Diode
SYMATTR Type diode
SYMBOL res -528 -1088 R0
SYMATTR InstName R2
SYMATTR Value 3k3
SYMBOL res -528 720 R0
SYMATTR InstName R3
SYMATTR Value 3k3
SYMBOL res -144 -1088 R0
SYMATTR InstName R14
SYMATTR Value 750
SYMBOL res -144 720 R0
SYMATTR InstName R16
SYMATTR Value 750
SYMBOL npn 288 400 R0
SYMATTR InstName Q3
SYMATTR Value 2SC3503F
SYMBOL pnp 288 -656 M180
WINDOW 0 77 84 Left 2
WINDOW 3 75 52 Left 2
SYMATTR InstName Q4
SYMATTR Value 2SA1381F
SYMBOL res 528 624 R0
SYMATTR InstName R21
SYMATTR Value 6.8
SYMBOL res 336 624 R0
SYMATTR InstName R27
SYMATTR Value 6.8
SYMBOL res 528 -992 R0
SYMATTR InstName R30
SYMATTR Value 6.8
SYMBOL res 336 -992 R0
SYMATTR InstName R36
SYMATTR Value 6.8
SYMBOL cap 464 176 R270
WINDOW 0 32 32 VTop 2
WINDOW 3 0 32 VBottom 2
SYMATTR InstName C1
SYMATTR Value 1n
SYMBOL res 432 -32 R0
SYMATTR InstName R40
SYMATTR Value 510
TEXT -48 -1488 Left 2 !;op
TEXT -752 -1344 Left 2 !.option plotwinsize=0
TEXT -752 -1312 Left 2 !.option noopiter
TEXT -752 -1616 Left 2 ;Transient
TEXT -752 -1456 Left 2 !.four {freq} 10 10 v(SPK+,SPK-)
TEXT -48 -1520 Left 2 !.param prb=0
TEXT -752 -1520 Left 2 !.param timestep {1/((262144/8)*freq)}
TEXT -752 -1552 Left 2 !.param freq 1k
TEXT -752 -1488 Left 2 !.param stoptime {iterations/freq}
TEXT -48 -1584 Left 2 !;ac oct 100 10 100meg
TEXT -48 -1552 Left 2 ;.step param prb list -1 1
TEXT -48 -1616 Left 2 ;AC analysis
TEXT -752 -1424 Left 2 !.param iterations 100
TEXT -416 -1280 Left 2 !.lib usr/ONNN_BJT.lib
TEXT -48 -1280 Left 2 !.param Zimp 6
TEXT 1920 -1120 Left 2 !.param Zreal Zimp/2
TEXT 1920 -1088 Left 2 !.param Zimg (Zimp*sqrt(3))/(4*pi*freq)
TEXT -48 -1248 Left 2 !.param supplyPWR 100
TEXT -48 -1216 Left 2 !.param supplyVLT 24
TEXT -416 -1216 Left 2 !.lib usr/STM_D.lib
TEXT -416 -1312 Left 2 !.lib usr/FCS_BJT.lib
TEXT -48 -1312 Left 2 !.param voutput 25
TEXT -48 -1184 Left 2 !.param supplyK 0.06
TEXT 2704 -448 Left 2 !.param rser {(supplyVLT*supplyVLT*supplyK)/(2*supplyPWR)}
TEXT -752 -1584 Left 2 !.tran 0 {stoptime} 1n {timestep}
TEXT 2704 -416 Left 2 !.param phi 90
TEXT 304 -1312 Left 2 !.param con1_len 15
TEXT 2704 -480 Left 2 !KCON1 LVCC LSGND LGSPK1 LGSPK2 LPGND LPWRGND1 LPWRGND2 LVEE LDGND 0.8
TEXT 304 -1280 Left 2 !.param con2_len 15m
TEXT 1920 -1152 Left 2 !KCON2 LSPKP LOUTR LSPKN1 LSPKN2 0.8
TEXT 2288 -272 Left 2 !KOTR LTRF LTRR 0.9
TEXT 1904 -1616 Left 2 ;Konektor zvucnika i zvucnik
TEXT 2672 -1616 Left 2 ;Konektor napajanja, star ground i napajanje
TEXT -48 -1344 Left 2 ;Ulazni parametri kola
TEXT 2288 -304 Left 2 ;Izlazni transformator
TEXT 2464 80 Center 2 ;AC sonda
TEXT 3464 -1048 Left 2 ;Masa digitalnog \ndela dolazi sa \nupravljacke ploce.
TEXT -416 -1344 Left 2 !.lib usr/FCS_D.lib
TEXT 304 -1248 Left 2 !.param BIAS 0.52
TEXT 304 -1216 Left 2 !.param OFFSET 0.5
TEXT 1904 -976 Left 2 ;Kolo za ponistavanje offset-a
TEXT -416 -1248 Left 2 !.lib usr/ONNN_D.lib
TEXT -1352 -424 Left 2 !.param ltp_re 51
RECTANGLE Normal -96 -1632 -768 -1392
RECTANGLE Normal -96 -1152 -768 -1360
RECTANGLE Normal 608 -1632 -64 -1392
RECTANGLE Normal 608 -1152 -64 -1360
RECTANGLE Normal 3840 -384 2656 -1632 2
RECTANGLE Normal 2592 -1056 1888 -1632 2
RECTANGLE Normal 2592 -256 2272 -320 2
RECTANGLE Normal 2288 16 2160 -176 2
RECTANGLE Normal 2592 544 2336 64 2
RECTANGLE Normal 3088 -720 2864 -1584 2
RECTANGLE Normal 2288 -1200 2064 -1584 2
RECTANGLE Normal 2368 16 2288 -176 2
RECTANGLE Normal 2592 -384 1888 -992 2

The netlist it stands for:
* pico.asc
V2 N038 0 SINE(0 {supplyVLT*sqrt(2)} 50 0 0 {phi}) Rser={rser}
Ii xp x 0 AC {u(prb)}
Vi x AC2 0 AC {u(-prb)}
R33 N044 N058 100
R34 N044 sgnd 1k8
D7 preout vcc+ 1N5404
D8 vcc- preout 1N5404
LTRF out1 N056 2µ Rser=10m Rpar=3meg Cpar=1p
R19 out1 N056 2.2
V1 x AC1 0
D6 N038 N003 GBPC3502
D9 N020 N039 GBPC3502
V3 0 N039 SINE(0 {supplyVLT*sqrt(2)} 50 0 0 {phi}) Rser={rser}
R54 out1 N059 4.7
R60 SPK+ N008 {Zreal}
L19 N008 SPK- {Zimg} Cpar=10p
V18 xp pwrgnd 0
Q16 vcc+ N047 N053 0 MJL3281A
Q17 vcc- N068 N066 0 CA_MJE15033C
Q18 vcc+ N043 N046 0 CA_MJE15032C
Q19 vcc- N067 N062 0 MJL1302A
R22 N067 N066 2
R23 N047 N046 2
C20 vcc+ pwrgnd 100n Rser=700m Lser=7n Rpar=4.4meg Cpar=1p
L10 N053 preout 40n Rser=220m Cpar=3p
L11 preout N062 40n Rser=220m Cpar=3p
C24 N059 pwrgnd 47n Rser=700m Lser=7n Rpar=4.4meg Cpar=1p
C25 pwrgnd vcc- 100n Rser=700m Lser=7n Rpar=4.4meg Cpar=1p
C2 N050 sgnd 2200µ V=10 Irms=1.25 Rser=0.08 Lser=10n Rpar=110k Cpar=3p
C6 N030 N020 6800µ V=50 Irms=2.5 Rser=0.08 Lser=20n Rpar=40k Cpar=3p mfg="Nichicon" pn="UVZ1H682MRD" type="Al electrolytic"
R§PBIAS1 N054 N057 {1+(500*BIAS)}
R52 N041 N054 1k2
D10 N039 N003 GBPC3502
D11 N020 N038 GBPC3502
LVCC vcc+ N002 {con1_len*20n} Rser={con1_len*.5m}
LVEE vcc- N029 {con1_len*20n} Rser={con1_len*.5m}
LTRR out2 N055 2µ Rser=80m Rpar=3meg Cpar=1p
C4 sgnd N044 2n2
V11 sinus sgnd SINE(0 {voutput/18} {freq})
R1 N046 N066 47
Q21 N042 N054 N065 0 MJE340
LGSPK2 gspk N012 {con1_len*20n} Rser={con1_len*.5m}
LPWRGND2 pwrgnd N017 {con1_len*20n} Rser={con1_len*.5m}
LPGND pgnd N013 {con1_len*20n} Rser={con1_len*.5m}
LSGND sgnd N005 {con1_len*20n} Rser={con1_len*.5m}
R18 N003 N002 25m
R26 N010 N012 25m
R28 dgnd N017 25m
R29 N014 N013 25m
R32 N006 N005 25m
R38 N020 N029 25m
L4 dgnd N022 2n Rser=1m
L5 N014 dgnd 2n Rser=1m
L6 N010 N014 2n Rser=1m
L18 N006 N010 2n Rser=1m
LSPKP SPKP N001 {con2_len*20n} Rser={con2_len*.5m}
LOUTR SPKE N004 {con2_len*20n} Rser={con2_len*.5m}
LSPKN2 gspk N011 {con2_len*20n} Rser={con2_len*.5m}
R35 SPKE N055 20m
R39 SPKP N056 20m
R41 SPK+ N001 25m
R42 SPK+ N004 25m
R43 SPK- N011 25m
LDGND pwrgnd N019 {con1_len*20n} Rser={con1_len*.5m}
R31 dgnd N019 25m
LPWRGND1 pwrgnd N015 {con1_len*20n} Rser={con1_len*.5m}
R25 dgnd N015 25m
V7 N033 sgnd PULSE(0 {voutput/18} 1u 1n 1n {1/(freq*2)} {1/freq})
V8 impulse N033 PULSE(0 {-voutput/18} {1u+(1/(freq*2))} 1n 1n {1/(freq*2)} {1/freq})
C11 N058 sinus 220µ V=6.3 Irms=290m Rser=0.5 Lser=3n Rpar=100k Cpar=3p mfg="Nichicon" pn="UPW0J221MED1TD" type="Al electrolytic"
C14 vcc+ pwrgnd 1000µ V=63 Irms=2.77 Rser=0.036 Lser=5n Rpar=100k Cpar=3p mfg="Nichicon" pn="UPW1J102MHD6" type="Al electrolytic"
C17 pwrgnd vcc- 1000µ V=63 Irms=2.77 Rser=0.036 Lser=5n Rpar=100k Cpar=3p mfg="Nichicon" pn="UPW1J102MHD6" type="Al electrolytic"
C16 N003 N031 6800µ V=50 Irms=2.5 Rser=0.08 Lser=20n Rpar=40k Cpar=3p mfg="Nichicon" pn="UVZ1H682MRD" type="Al electrolytic"
C22 N021 N020 6800µ V=50 Irms=2.5 Rser=0.08 Lser=20n Rpar=40k Cpar=3p mfg="Nichicon" pn="UVZ1H682MRD" type="Al electrolytic"
C23 N003 N023 6800µ V=50 Irms=2.5 Rser=0.08 Lser=20n Rpar=40k Cpar=3p mfg="Nichicon" pn="UVZ1H682MRD" type="Al electrolytic"
L3 N021 N022 2n Rser=1m
L7 N030 0 2n Rser=1m
L8 N022 N023 2n Rser=1m
L9 0 N031 2n Rser=1m
L12 N022 0 2n Rser=1m
R37 N057 N065 200
R51 vcc+ N028 100k
R62 N040 vcc- 100k
D13 N028 sgnd MMSD4148
D14 sgnd N040 MMSD4148
R§POFFSET1 N028 N036 {1+(10k*OFFSET)}
R§POFFSET2 N036 N040 {1+(10k*(1-OFFSET))}
R65 N037 N036 1k
C26 sgnd N037 22µ V=50 Irms=90m Rser=2 Lser=2n Rpar=2meg Cpar=2p mfg="Panasonic" pn="ECEA1HN220U" type="Al bipolar"
R66 preout N037 22k
V4 AC1 preout 0
V6 out1 AC2 0
R68 N068 N065 22
R69 N043 N042 22
LGSPK1 gspk N009 {con1_len*20n} Rser={con1_len*.5m}
R78 N010 N009 25m
LSPKN1 gspk N007 {con2_len*20n} Rser={con2_len*.5m}
R79 SPK- N007 25m
V9 N034 sgnd SINE(0 {voutput/72} 19k)
V10 N025 N034 SINE(0 {voutput/72} 17k)
Q1 N065 N071 N073 0 2SC3503F
R10 N042 N041 11
C8 N042 N065 47µ V=6.3 Irms=290m Rser=0.5 Lser=3n Rpar=100k Cpar=3p mfg="Nichicon" pn="UPW0J221MED1TD" type="Al electrolytic"
C18 N063 N064 120p
Q14 N071 N044 N060 0 CA_BC560C
C9 N041 N065 100n Rser=30m Lser=3n Rpar=700k
R8 N045 N063 1m
V12 N018 N025 SINE(0 {voutput/72} 3k)
V13 imd N018 SINE(0 {voutput/72} 5k)
R24 N051 N060 {ltp_re}
Q2 N041 N027 N024 0 2SA1381F
Q6 N027 N044 N048 0 CA_BC550C
R5 N048 N052 {ltp_re}
R12 N071 vcc- 750
R13 vcc+ N027 750
Q7 N035 N045 N049 0 CA_BC550C
R6 N049 N052 {ltp_re}
R11 N051 N061 {ltp_re}
Q8 N069 N045 N061 0 CA_BC560C
R17 N045 N050 100
R20 out1 N045 1k8
R9 N074 vcc- 27
R15 vcc+ N016 27
R4 N026 N051 2k7
R7 N052 N070 2k7
D2 pgnd N026 BZX84C12L
D5 N070 pgnd BZX84C12L
R2 vcc+ N026 3k3
R3 N070 vcc- 3k3
R14 vcc+ N035 750
R16 N069 vcc- 750
Q3 pgnd N069 N072 0 2SC3503F
Q4 pgnd N035 N032 0 2SA1381F
R21 N073 N074 6.8
R27 N072 N074 6.8
R30 N016 N024 6.8
R36 N016 N032 6.8
C1 N064 N065 1n
R40 preout N064 510
.model D D
.lib standard.dio
.model NPN NPN
.model PNP PNP
.lib standard.bjt
;op
.option plotwinsize=0
.option noopiter
* Transient
.four {freq} 10 10 v(SPK+,SPK-)
.param prb=0
.param timestep {1/((262144/8)*freq)}
.param freq 1k
.param stoptime {iterations/freq}
;ac oct 100 10 100meg
* .step param prb list -1 1
* AC analysis
.param iterations 100
.lib usr/ONNN_BJT.lib
.param Zimp 6
.param Zreal Zimp/2
.param Zimg (Zimp*sqrt(3))/(4*pi*freq)
.param supplyPWR 100
.param supplyVLT 24
.lib usr/STM_D.lib
.lib usr/FCS_BJT.lib
.param voutput 25
.param supplyK 0.06
.param rser {(supplyVLT*supplyVLT*supplyK)/(2*supplyPWR)}
.tran 0 {stoptime} 1n {timestep}
.param phi 90
.param con1_len 15
KCON1 LVCC LSGND LGSPK1 LGSPK2 LPGND LPWRGND1 LPWRGND2 LVEE LDGND 0.8
.param con2_len 15m
KCON2 LSPKP LOUTR LSPKN1 LSPKN2 0.8
KOTR LTRF LTRR 0.9
* Konektor zvucnika i zvucnik
* Konektor napajanja, star ground i napajanje
* Ulazni parametri kola
* Izlazni transformator
* AC sonda
* Masa digitalnog
* dela dolazi sa
* upravljacke ploce.
.lib usr/FCS_D.lib
.param BIAS 0.52
.param OFFSET 0.5
* Kolo za ponistavanje offset-a
.lib usr/ONNN_D.lib
.param ltp_re 51
.backanno
.end